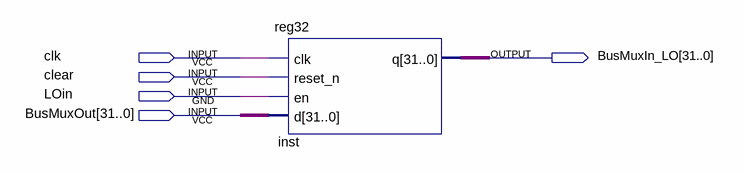
[diagram p0: schematic sheet]
// Quartus schematic lo_design.bdf as structural Verilog: 1 symbols, 5 pins
module lo_design (
  input  clk,
  input  clear,
  input  LOin,
  input  [31:0] BusMuxOut,
  output [31:0] BusMuxIn_LO
);

  reg32 inst (.clk(clk), .reset_n(clear), .en(LOin), .d(BusMuxOut), .q(BusMuxIn_LO));
endmodule
